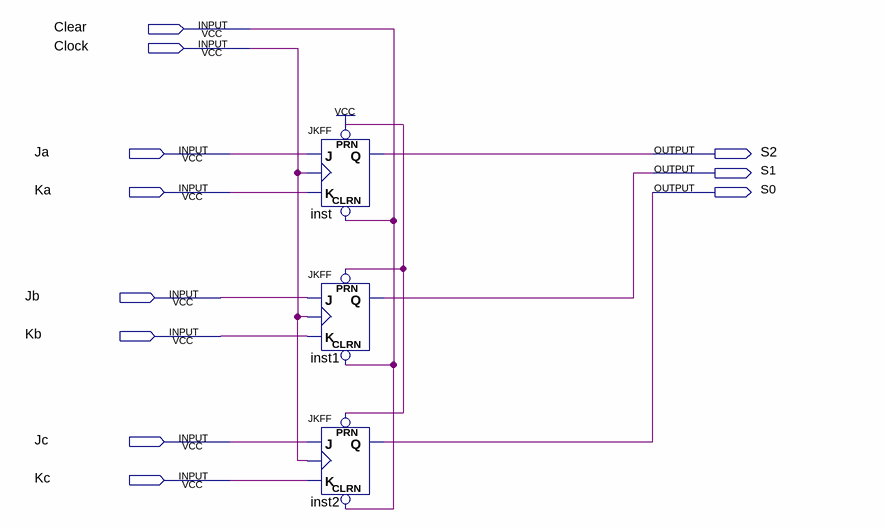
[diagram p0: schematic sheet]
// Quartus schematic 3jkff.bdf as structural Verilog: 3 symbols, 11 pins
module \3jkff  (
  input  Clear,
  input  Clock,
  input  Ja,
  input  Ka,
  input  Jb,
  input  Kb,
  input  Jc,
  input  Kc,
  output S2,
  output S1,
  output S0
);

  JKFF inst (.PRN(1'b1), .CLRN(Clear), .K(Ka), .J(Ja), .CLK(Clock), .Q(S2));
  JKFF inst1 (.PRN(1'b1), .CLRN(Clear), .K(Kb), .J(Jb), .CLK(Clock), .Q(S1));
  JKFF inst2 (.PRN(1'b1), .CLRN(Clear), .K(Kc), .J(Jc), .CLK(Clock), .Q(S0));
endmodule
